# EAGLE design Rocketometer2148 MPU9150 GPS No Osc (EAGLE 6.2)
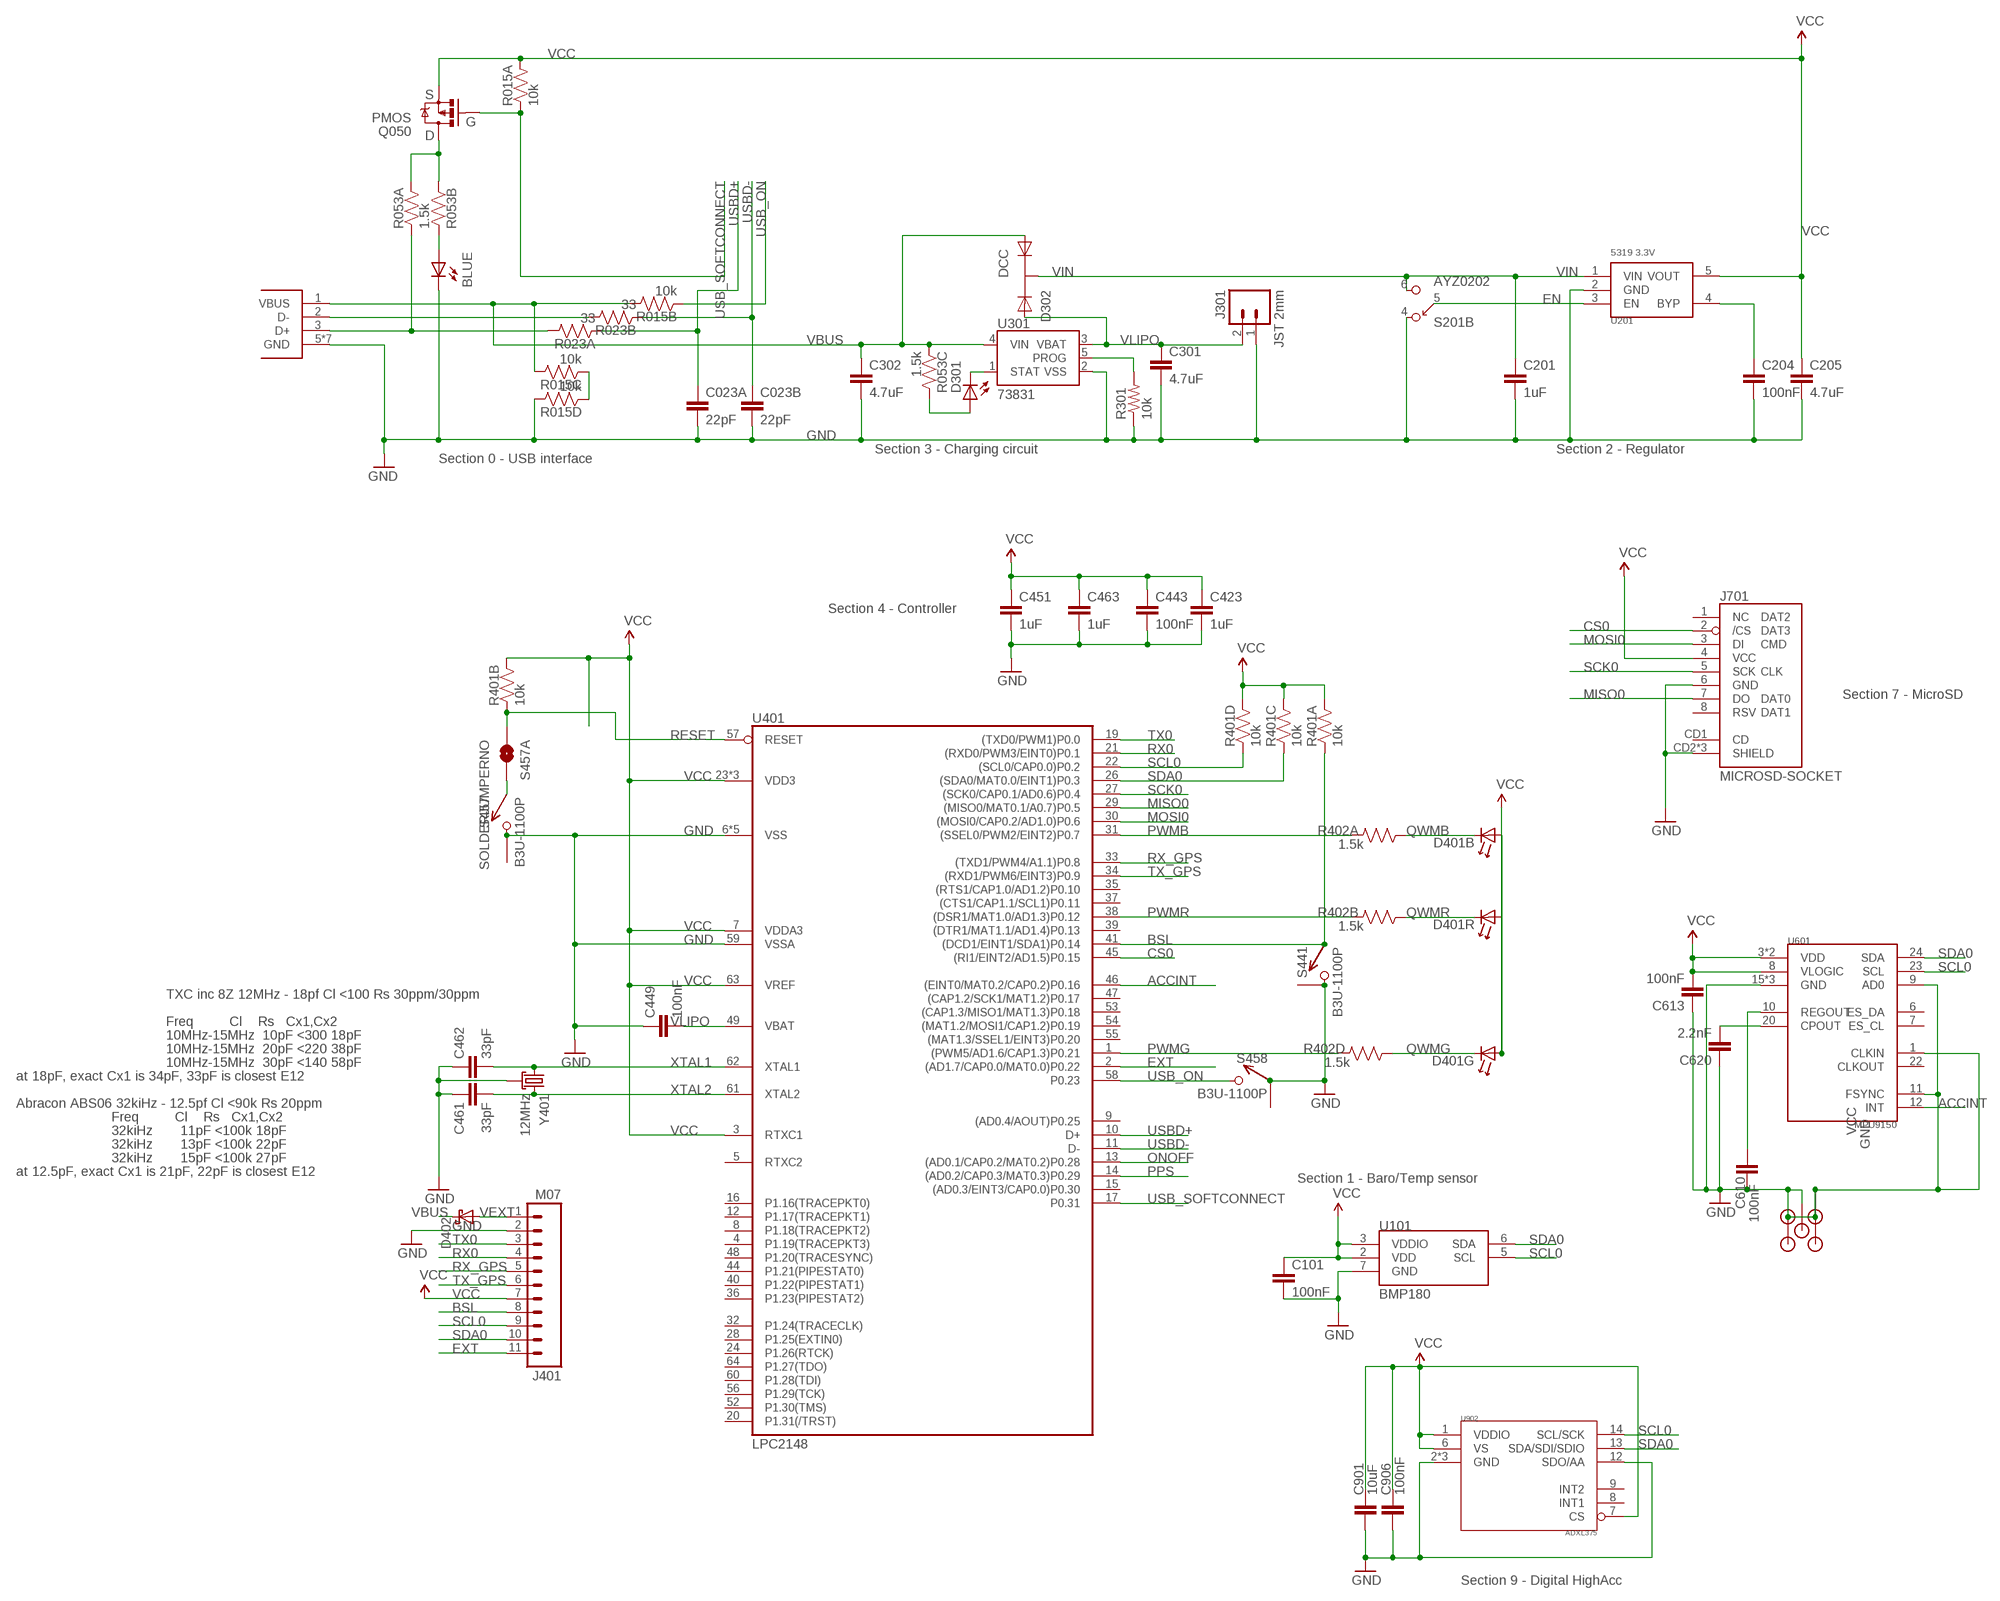
[diagram p0: schematic, sheet 1, part 1 of 2]
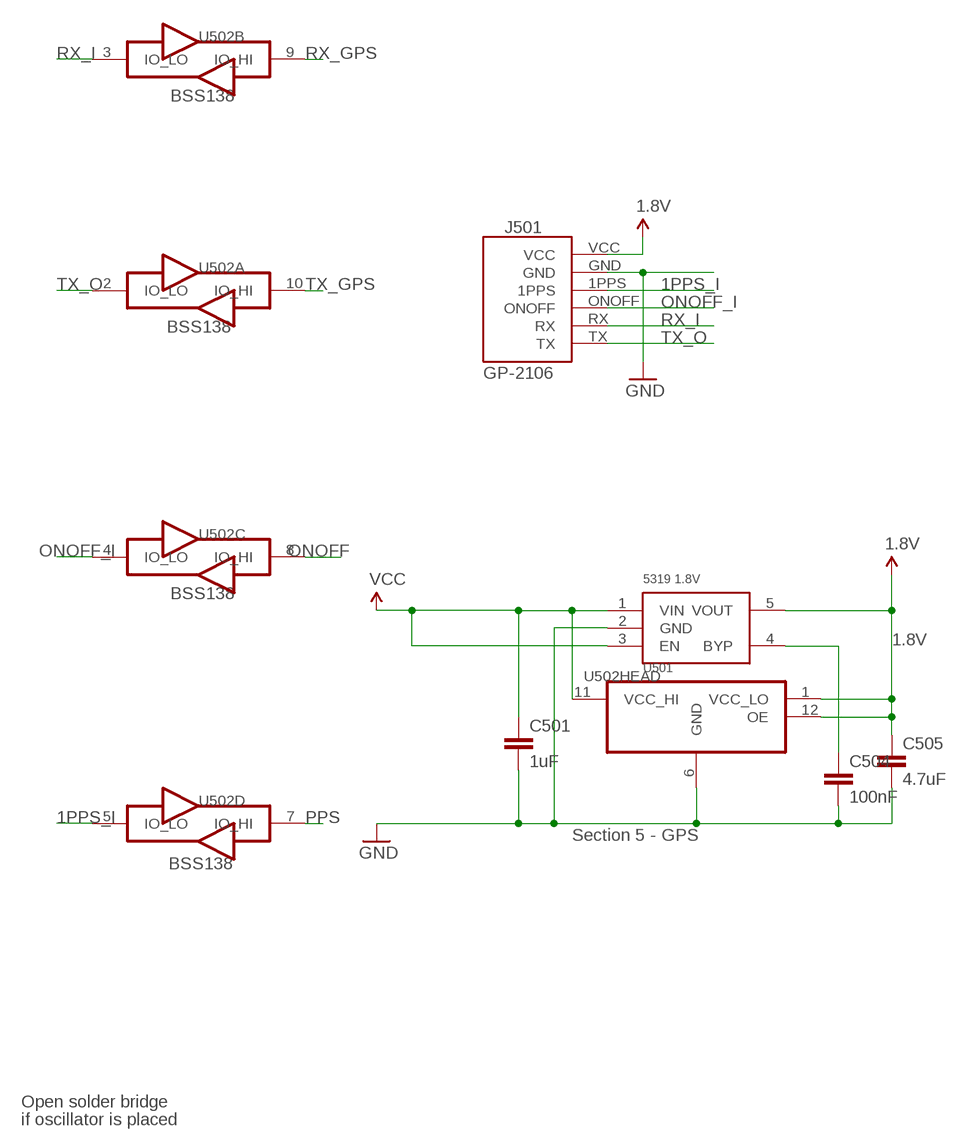
[diagram p1: schematic, sheet 1, part 2 of 2]

## Parts
C023  22pF  CKCM25  [CKCM25]
C101  100nF  CAP0402-CAP  [0402-CAP]
C201  1uF  CAP0402-CAP  [0402-CAP]
C204  100nF  CAP0402-CAP  [0402-CAP]
C205  4.7uF  CAP0402-CAP  [0402-CAP]
C301  4.7uF  CAP0402-CAP  [0402-CAP]
C302  4.7uF  CAP0402-CAP  [0402-CAP]
C423  1uF  CAP0402-CAP  [0402-CAP]
C443  100nF  CAP0402-CAP  [0402-CAP]
C449  100nF  CAP0402-CAP  [0402-CAP]
C451  1uF  CAP0402-CAP  [0402-CAP]
C461  33pF  CAP0402-CAP  [0402-CAP]
C462  33pF  CAP0402-CAP  [0402-CAP]
C463  1uF  CAP0402-CAP  [0402-CAP]
C501  1uF  CAP0402-CAP  [0402-CAP]
C504  100nF  CAP0402-CAP  [0402-CAP]
C505  4.7uF  CAP0402-CAP  [0402-CAP]
C610  100nF  CAP0402-CAP  [0402-CAP]
C613  100nF  CAP0402-CAP  [0402-CAP]
C620  2.2nF  CAP0402-CAP  [0402-CAP]
C901  10uF  CAP0603-CAP  [0603-CAP]
C906  100nF  CAP0402-CAP  [0402-CAP]
D050  BLUE  LED0603  [LED-0603]
D301  YELLOW  LED0603  [LED-0603]
D302  DCC  PMEG2005CT  [SOT-23-3]
D401  SMLP36RGB2W(R)  [SMLP36]
D402  DIODE_SCHOTTKY  [D0603]
J001  USB_MICROB_JSTGCT  [USB_MICROB_3075]
J301  JST 2mm  M02-JST-2MM-SMT  [JST-2-SMD]
J401  M07  M11PTH  [1X11]
J501  GP-2106  [GP-2106]
J701  MICROSD-SOCKET  [MICROSD-SOCKET-PP]
JP1  STANDOFF  [STANDOFF]
JP2  STANDOFF  [STANDOFF]
JP3  STANDOFF  [STANDOFF]
JP4  STANDOFF  [STANDOFF]
JP5  STANDOFF  [STANDOFF]
Q050  PMOS  MOSFET-PCHANNELSMD  [SOT23-3]
R015  10k  RP404  [CRA04]
R023  33  RP2EXB24V  [CRA02]
R053  1.5k  RP404  [CRA04]
R301  10k  RESISTOR0402-RES  [0402-RES]
R401  10k  RP404  [CRA04]
R402  1.5k  RP404  [CRA04]
S201  AYZ0202  [AYZ0202]
S441  B3U-1100P  [B3U-1100P]
S457  B3U-1100P  [B3U-1100P]
S457A  SOLDERJUMPERNO  [SJ_2S-NO]
S458  B3U-1100P  [B3U-1100P]
U101  BMP180  [BMP180]
U201  5319 3.3V  MIC5319D5  [SOT-23-5]
U301  73831  MCP73831  [SOT23-5]
U401  LPC2148  [LQFP64]
U501  5319 1.8V  MIC5319D5  [SOT-23-5]
U502  TXB0104RUT  [R-PUQFN-N12]
U601  MPU9150  [LLGA24]
U902  ADXL375  [ADXL375]
Y401  12MHz  CX2520  [CRYSTAL_SMD_2MM_2_5MM]

## Nets
1.8V: C505.1 J501.VCC U501.5(VOUT) U502.1(HEAD:VCC_LO) U502.12(HEAD:OE)
1PPS_I: J501.1PPS U502.5(D:IO_LO)
ACCINT: U401.46((EINT0/MAT0.2/CAP0.2)P0.16) U601.12(INT)
BSL: J401.8 R401.1 S441.P$1 U401.41((DCD1/EINT1/SDA1)P0.14)
CHARGE_STAT+: D301.A R053.6
CHARGE_STAT-: D301.C U301.1(STAT)
CONN_D+: J001.3(D+) R023.4 R053.1
CONN_D-: J001.2(D-) R023.3
CS0: J701.2(/CS) U401.45((RI1/EINT2/AD1.5)P0.15)
EN: S201.5 U201.3(EN)
EXT: J401.11 U401.2((AD1.7/CAP0.0/MAT0.0)P0.22)
GND [power]: C023.3 C023.4 C101.2 C201.2 C204.2 C205.2 C301.2 C302.2 C423.2 C443.2 C449.1 C451.2 C461.1 C462.1 C463.2 C501.2 C504.2 C505.2 C610.2 C613.1 C620.1 C901.2 C906.2 D050.C J001.5(GND) J001.P$1(GND) J001.P$2(GND) J001.P$3(GND) J001.P$4(GND) J001.P$8(GND) J001.P$10(GND) J301.1 J401.2 J501.GND J701.6(GND) J701.CD2(SHIELD) J701.GND1(SHIELD) J701.GND3(SHIELD) JP1.P$1 JP2.P$1 JP3.P$1 JP4.P$1 JP5.P$1 R015.5 R301.1 S201.4 S441.P$2 S441.P$3 S457.P$2 S457.P$3 S458.P$1 S458.P$3 U101.7(GND) U201.2(GND) U301.2(VSS) U401.6(VSS) U401.18(VSS) U401.25(VSS) U401.42(VSS) U401.50(VSS) U401.59(VSSA) U501.2(GND) U502.6(HEAD:GND) U601.1(CLKIN) U601.9(AD0) U601.11(FSYNC) U601.15(GND) U601.17(GND) U601.18(GND) U902.2(GND) U902.4(GND) U902.5(GND) U902.12(SDO/AA) Y401.2(GND) Y401.4(GND)
MISO0: J701.7(DO) U401.29((MISO0/MAT0.1/A0.7)P0.5)
MOSI0: J701.3(DI) U401.30((MOSI0/CAP0.2/AD1.0)P0.6)
N$1: C620.2 U601.20(CPOUT)
N$2: R301.2 U301.5(PROG)
N$3: R015.3 R015.4
N$9 [power]: S457.P$1 S457A.2
N$12: C504.1 U501.4(BYP)
N$13: C610.1 U601.10(REGOUT)
N$17: C204.1 U201.4(BYP)
ONOFF: U401.13((AD0.1/CAP0.2/MAT0.2)P0.28) U502.8(C:IO_HI)
ONOFF_I: J501.ONOFF U502.4(C:IO_LO)
PPS: U401.14((AD0.2/CAP0.3/MAT0.3)P0.29) U502.7(D:IO_HI)
PWMB: R402.8 U401.31((SSEL0/PWM2/EINT2)P0.7)
PWMG: R402.5 U401.1((PWM5/AD1.6/CAP1.3)P0.21)
PWMR: R402.7 U401.38((DSR1/MAT1.0/AD1.3)P0.12)
QWMB: D401.1(B:C) R402.1
QWMG: D401.5(G:C) R402.4
QWMR: D401.3(R:C) R402.2
RESET [power]: R401.2 S457A.1 U401.57(RESET)
RX0: J401.4 U401.21((RXD0/PWM3/EINT0)P0.1)
RX_GPS: J401.5 U401.33((TXD1/PWM4/A1.1)P0.8) U502.9(B:IO_HI)
RX_I: J501.RX U502.3(B:IO_LO)
SCK0: J701.5(SCK) U401.27((SCK0/CAP0.1/AD0.6)P0.4)
SCL0: J401.9 R401.4 U101.5(SCL) U401.22((SCL0/CAP0.0)P0.2) U601.23(SCL) U902.14(SCL/SCK)
SDA0: J401.10 R401.3 U101.6(SDA) U401.26((SDA0/MAT0.0/EINT1)P0.3) U601.24(SDA) U902.13(SDA/SDI/SDIO)
TX0: J401.3 U401.19((TXD0/PWM1)P0.0)
TX_GPS: J401.6 U401.34((RXD1/PWM6/EINT3)P0.9) U502.10(A:IO_HI)
TX_O: J501.TX U502.2(A:IO_LO)
USB_ON: R015.2 S458.P$2 U401.58(P0.23)
USB_SOFTCONNECT: Q050.1(G) R015.1 U401.17(P0.31)
USBD+: C023.1 R023.1 U401.10(D+)
USBD-: C023.2 R023.2 U401.11(D-)
USBLIGHT+: D050.A R053.7
USBON+: Q050.3(D) R053.2 R053.8
VBUS [power]: C302.1 D302.1(A1) D402.C(K) J001.1(VBUS) R015.6 R015.7 R053.3 U301.4(VIN)
VCC [power]: C101.1 C205.1 C423.1 C443.1 C451.1 C463.1 C501.1 C613.2 C901.1 C906.1 D401.2(B:A) D401.4(R:A) D401.6(G:A) J401.7 J701.4(VCC) Q050.2(S) R015.8 R401.5 R401.6 R401.7 R401.8 U101.2(VDD) U101.3(VDDIO) U201.5(VOUT) U401.3(RTXC1) U401.7(VDDA3) U401.23(VDD3) U401.43(VDD3) U401.51(VDD3) U401.63(VREF) U501.1(VIN) U501.3(EN) U502.11(HEAD:VCC_HI) U601.3(VDD) U601.8(VLOGIC) U601.13(VDD) U902.1(VDDIO) U902.6(VS) U902.7(CS)
VEXT [power]: D402.A J401.1
VIN: C201.1 D302.3(K) S201.6 U201.1(VIN)
VLIPO [power]: C301.1 C449.2 D302.2(A2) J301.2 U301.3(VBAT) U401.49(VBAT)
XTAL1: C462.2 U401.62(XTAL1) Y401.1
XTAL2: C461.2 U401.61(XTAL2) Y401.3
Unconnected: J701.1(NC) J701.8(RSV) J701.CD1(CD) R053.4 R053.5 R402.3 R402.6 S201.1 S201.2 S201.3 U401.4(P1.19(TRACEPKT3)) U401.5(RTXC2) U401.8(P1.18(TRACEPKT2)) U401.9((AD0.4/AOUT)P0.25) U401.12(P1.17(TRACEPKT1)) U401.15((AD0.3/EINT3/CAP0.0)P0.30) U401.16(P1.16(TRACEPKT0)) U401.20(P1.31(/TRST)) U401.24(P1.26(RTCK)) U401.28(P1.25(EXTIN0)) U401.32(P1.24(TRACECLK)) U401.35((RTS1/CAP1.0/AD1.2)P0.10) U401.36(P1.23(PIPESTAT2)) U401.37((CTS1/CAP1.1/SCL1)P0.11) U401.39((DTR1/MAT1.1/AD1.4)P0.13) U401.40(P1.22(PIPESTAT1)) U401.44(P1.21(PIPESTAT0)) U401.47((CAP1.2/SCK1/MAT1.2)P0.17) U401.48(P1.20(TRACESYNC)) U401.52(P1.30(TMS)) U401.53((CAP1.3/MISO1/MAT1.3)P0.18) U401.54((MAT1.2/MOSI1/CAP1.2)P0.19) U401.55((MAT1.3/SSEL1/EINT3)P0.20) U401.56(P1.29(TCK)) U401.60(P1.28(TDI)) U401.64(P1.27(TDO)) U601.6(ES_DA) U601.7(ES_CL) U601.22(CLKOUT) U902.8(INT1) U902.9(INT2)

## Notes on the sheet
- S
- G
- D
- BSS138
- Section 0 - USB interface | Section 3 - Charging circuit | Section 2 - Regulator
- BSS138
- Section 4 - Controller
- BSS138
- Section 7 - MicroSD
- Section 5 - GPS
- BSS138
- TXC inc 8Z 12MHz - 18pf Cl <100 Rs 30ppm/30ppm
- Freq         Cl    Rs   Cx1,Cx2
- 10MHz-15MHz  10pF <300 18pF
- 10MHz-15MHz  20pF <220 38pF
- 10MHz-15MHz  30pF <140 58pF | Open solder bridge
- at 18pF, exact Cx1 is 34pF, 33pF is closest E12 | if oscillator is placed
- Abracon ABS06 32kiHz - 12.5pf Cl <90k Rs 20ppm
- Freq         Cl    Rs   Cx1,Cx2
- 32kiHz       11pF <100k 18pF
- 32kiHz       13pF <100k 22pF
- 32kiHz       15pF <100k 27pF
- at 12.5pF, exact Cx1 is 21pF, 22pF is closest E12
- Section 1 - Baro/Temp sensor
- Section 9 - Digital HighAcc

## Library data of the parts
C023 = KwanSystems:CKC; DIGIKEY: 445-1860-1-ND
C101 C204 C443 C449 C504 C610 C613 = SparkFun:CAP: Capacitor Standard 0603 ceramic capacitor, and 0.1" leaded capacitor.; DIGIKEY: 445-1265-1-ND
C201 C423 C451 C463 C501 = SparkFun:CAP: Capacitor Standard 0603 ceramic capacitor, and 0.1" leaded capacitor.; DIGIKEY: 445-4114-1-ND
C205 C301 C302 C505 = SparkFun:CAP: Capacitor Standard 0603 ceramic capacitor, and 0.1" leaded capacitor.; DIGIKEY: 445-7395-1-ND
C461 C462 = SparkFun:CAP: Capacitor Standard 0603 ceramic capacitor, and 0.1" leaded capacitor.; DIGIKEY: 445-1241-1-ND
C620 = SparkFun:CAP: Capacitor Standard 0603 ceramic capacitor, and 0.1" leaded capacitor.; DIGIKEY: 445-1257-1-ND
C901 = SparkFun:CAP: Capacitor Standard 0603 ceramic capacitor, and 0.1" leaded capacitor.; DIGIKEY: 445-7486-1-ND
C906 = SparkFun-Passives:CAP: Capacitor Standard 0603 ceramic capacitor, and 0.1" leaded capacitor.; DIGIKEY: 445-1265-1-ND
D050 = SparkFun:LED: LEDs Standard schematic elements and footprints for 5mm, 3mm, 1206, and 0603 sized LEDs. 5mm - Spark Fun Electronics SKU : COM-00529 (and others); DIGIKEY: 350-2037-1-ND
D301 = SparkFun:LED: LEDs Standard schematic elements and footprints for 5mm, 3mm, 1206, and 0603 sized LEDs. 5mm - Spark Fun Electronics SKU : COM-00529 (and others); DIGIKEY: 350-2032-1-ND
D302 = KwanSystems:PMEG2005CT; DIGIKEY: 568-6500-1-ND
D401 = KwanSystems:SMLP36RGB2W(R); DIGIKEY: 846-1097-1-ND
D402 = KwanSystems:DIODE_SCHOTTKY
J001 = KwanSystems:USB_MICROB_JST; DIGIKEY: 609-4616-2-ND
J301 = SparkFun:M02: Header 2 Standard 2-pin 0.1" header. Use with straight break away headers (SKU : PRT-00116), right angle break away headers (PRT-00553), swiss pins (PRT-00743), machine pins (PRT-00117), and female headers (PRT-00115). Molex polarized connector foot print use with SKU : PRT-08233 with associated crimp pins and housings.; DIGIKEY: 455-1749-1-ND
J401 = SparkFun-Connectors:M11: Header 11 Standard 11-pin 0.1" header. Use with straight break away headers (SKU : PRT-00116), right angle break away headers (PRT-00553), swiss pins (PRT-00743), machine pins (PRT-00117), and female headers (PRT-00115).; DIGIKEY: $NOPART
J501 = SparkFun:GP-2106: GP-2106 GPS SiRF IV
J701 = KwanSystems:MICROSD-SOCKET: microSD Socket Push-push type uSD socket. Digikey 101-00660-68-6-1-ND. tDoc lines correctly indicate media card edge positions when inserting (unlocked, locked, depressed).; DIGIKEY: 101-00581-59-1-ND
JP1-JP5 = KwanSystems:STANDOFF; DIGIKEY: $NOPART
Q050 = SparkFun:MOSFET-PCHANNEL; DIGIKEY: NTR1P02T1GOSCT-ND
R015 = KwanSystems:RP4; DIGIKEY: Y5103CT-ND
R023 = KwanSystems:RP2
R053 R402 = KwanSystems:RP4; DIGIKEY: CRA4S81.5KCT-ND
R301 = SparkFun:RESISTOR: Resistor Basic schematic elements and footprints for 0603, 1206, and PTH resistors.; DIGIKEY: P10.0KLCT-ND
R401 = KwanSystems:RP4; DIGIKEY: CRA4S810KCT-ND
S201 = KwanSystems:AYZ0202; DIGIKEY: 401-2013-1-ND
S441 S457 S458 = KwanSystems:B3U-1100P; DIGIKEY: SW1021CT-ND
S457A = SparkFun-Passives:SOLDERJUMPER: Solder Jumper Standard SMD solder jumper. Used to automate production. Two varients : Normally Open and Normally Closed are the same, but have different paste layers. NC will have a large amount of paste and should jumper during reflow.; DIGIKEY: $NOPART
U101 = KwanSystems:BMP180; DIGIKEY: 828-1027-1-ND
U201 U501 = KwanSystems:MIC5319; DIGIKEY: 576-1910-1-ND
U301 = SparkFun:MCP73831: Microchip's MCP73831 Miniature single cell, fully integrated Li-Ion, Li-polymer charge management controller http://ww1.microchip.com/downloads/en/DeviceDoc/21984a.pdf; DIGIKEY: MCP73831T-2ACI/OTCT-ND
U401 = KwanSystems:LPC2148
U502 = KwanSystems:TXB0104
U601 = KwanSystems:MPU9150; DIGIKEY: $NOPART
U902 = KwanSystems:ADXL375; DIGIKEY: ADXL375BCCZ-ND
Y401 = KwanSystems:CX2520; DIGIKEY: 887-1487-1-ND

## Net classes
0 default: width 0.152 mm, drill 0.33 mm, clearance 0.152 mm
1 power: width 0.152 mm, drill 0.33 mm, clearance 0.152 mm to class 0, clearance 0.152 mm
2 hv: width 0.152 mm, drill 0.33 mm, clearance 0.152 mm to class 0, clearance 0.152 mm to class 1, clearance 0.152 mm

## Board
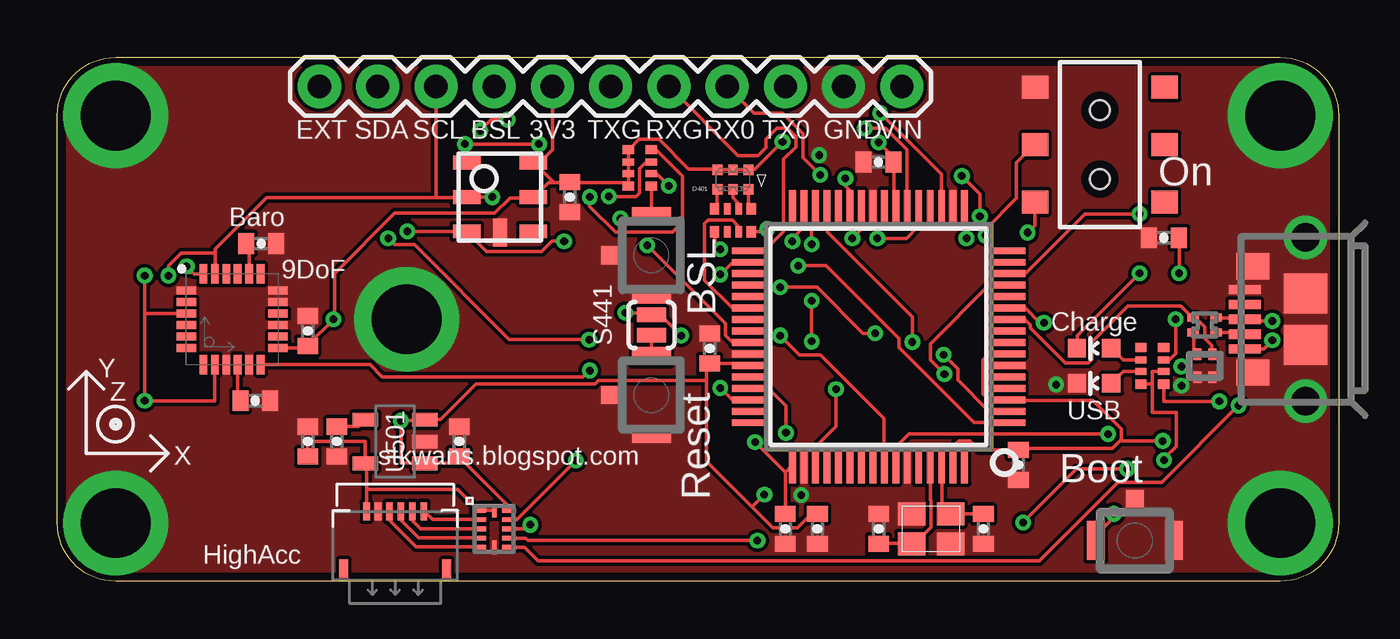
[diagram p2: board, top side]
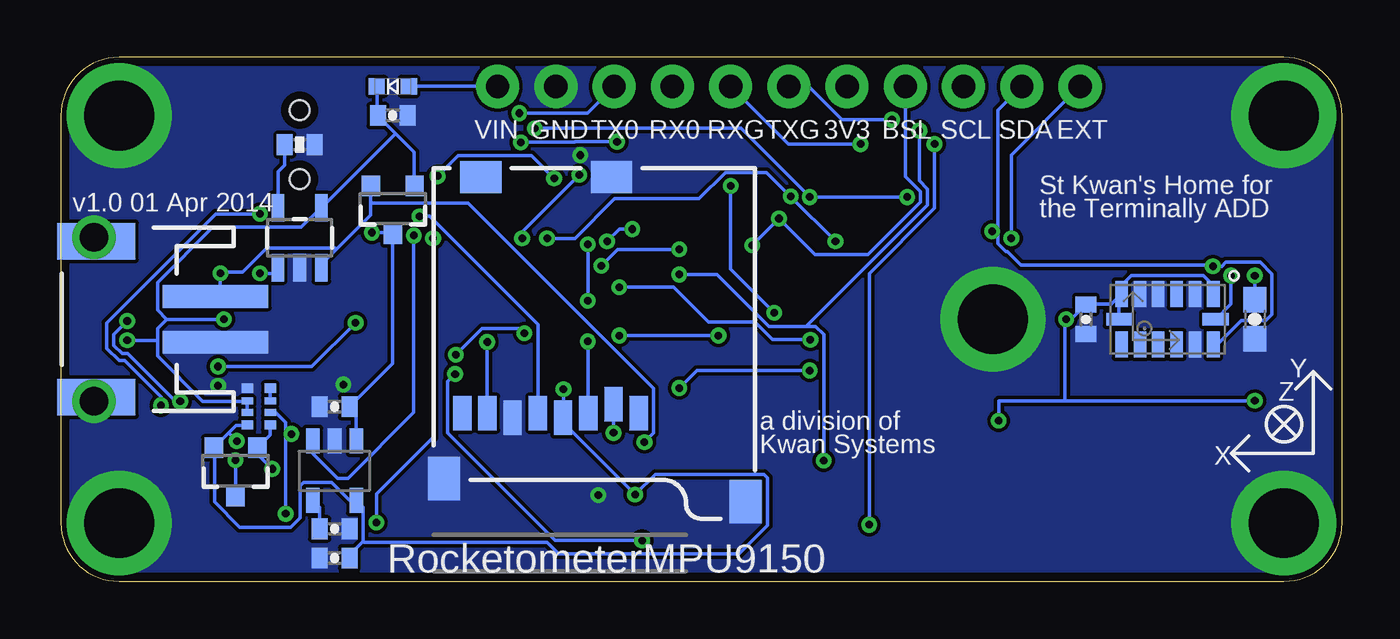
[diagram p3: board, bottom side, seen from below]

Size 55.88 x 22.86 mm. Coordinates in mm from the lower left corner, seen from the top.
Outline: 2.54,22.86 53.34,22.86 arc-90 55.88,20.32 55.88,2.54 arc-90 53.34,0 2.54,0 arc-90 0,2.54 0,20.32 arc-90 2.54,22.86
Copper layers (1*16): Top 0.0356mm / dielectric 1.5011mm / Bottom 0.0356mm
Design rules: minimum track width 6mil, minimum drill 13mil, track to track 6mil, track to pad 6mil, pad to pad 6mil, via to via 6mil, smd to smd 6mil, copper to edge 15mil, drill to drill 6mil, minimum pad ring 7mil, minimum via ring 7mil, stop-mask expansion 4mil, vias tented up to drill 14mil, thermal gap 10mil

### Footprints (pad centres in the part's own frame; a part is rotated, then mirrored left to right if it is on the bottom)
CKCM25 = smd 0.35 x 0.5: 1 -0.325,-0.5; 2 0.325,-0.5; 3 0.325,0.5; 4 -0.325,0.5
0402-CAP = smd 0.7 x 0.9: 1 -0.65,0; 2 0.65,0
0603-CAP = smd 1.1 x 1: 1 -0.85,0; 2 0.85,0
LED-0603 = smd 0.8 x 0.8: A 0,-0.75; C 0,0.75
SOT-23-3 = smd 0.9 x 0.8: 1 -1,0.95; 2 -1,-0.95; 3 1.1,0
SMLP36 = smd 0.45 x 0.45: 1 -0.675,0.425; 2 -0.675,-0.425; 5 0.675,0.425; 6 0.675,-0.425 | smd 0.4 x 0.45: 3 0,0.425; 4 0,-0.425
D0603 = smd 0.7 x 0.7: A -0.7,0; C 0.7,0
USB_MICROB_3075 = smd 0.4 x 1.4: 1 -1.3,4.1; 2 -0.65,4.1; 3 0,4.1; 4 0.65,4.1; 5 1.3,4.1 | smd 1.15 x 1.45: P$1 2.32,3.75; P$10 -2.32,3.75 | smd 1.75 x 1.9: P$2 1.125,1.45; P$8 -1.125,1.45 | drill 1.25 pad 1.9: P$3 -3.575,1.45; P$4 3.575,1.45
JST-2-SMD = smd 1 x 4.6: 1 -1,-3.7; 2 1,-3.7 | smd 1.6 x 3.4: NC1 -3.4,1.5; NC2 3.4,1.5
1X11 = drill 1.016 pad 1.88: 1 0,0; 2 2.54,0; 3 5.08,0; 4 7.62,0; 5 10.16,0; 6 12.7,0; 7 15.24,0; 8 17.78,0; 9 20.32,0; 10 22.86,0; 11 25.4,0
GP-2106 = smd 0.3 x 0.8: 1PPS -0.25,0; GND -0.75,0; ONOFF 0.25,0; RX 0.75,0; TX 1.25,0; VCC -1.25,0 | smd 0.4 x 0.8: P$7 -2.25,-2.5; P$8 2.25,-2.5
MICROSD-SOCKET-PP = smd 0.8 x 1.5: 1 -8.94,10.7; 2 -7.84,10.3; 3 -6.74,10.7; 4 -5.64,10.9; 5 -4.54,10.7; 6 -3.44,10.9; 7 -2.34,10.7; 8 -1.24,10.7 | smd 1.8 x 1.4: CD1 -2.05,0.4; CD2 -7.75,0.4 | smd 1.4 x 1.9: GND1 -13.6,14.55; GND3 -0.45,13.55
STANDOFF = drill 3.048 pad 4.572: P$1 0,0
SOT23-3 = smd 0.8 x 0.9: 1 -0.95,-1; 2 0.95,-1; 3 0,1.1
CRA04 = smd 0.4 x 0.5: 1 -0.8,-0.5; 4 0.8,-0.5; 5 0.8,0.5; 8 -0.8,0.5 | smd 0.3 x 0.5: 2 -0.25,-0.5; 3 0.25,-0.5; 6 0.25,0.5; 7 -0.25,0.5
CRA02 = smd 0.35 x 0.5: 1 -0.325,-0.5; 2 0.325,-0.5; 3 0.325,0.5; 4 -0.325,0.5
0402-RES = smd 0.7 x 0.9: 1 -0.65,0; 2 0.65,0
AYZ0202 = smd 1 x 1.15: 1 -2.5,2.825; 2 0,2.825; 3 2.5,2.825; 4 -2.5,-2.825; 5 0,-2.825; 6 2.5,-2.825 | hole 0.85: 1.5,0; -1.5,0
B3U-1100P = smd 0.8 x 1.7: P$1 -1.7,0; P$2 1.7,0 | smd 0.8 x 1.1: P$3 0,-1.65
SJ_2S-NO = smd 0.635 x 1.27: 1 -0.45,0; 2 0.45,0
BMP180 = smd 0.6 x 1.2: 1 1.5,1.45; 2 0,1.45; 3 -1.5,1.45; 4 -1.5,-1.45; 5 0,-1.45; 6 1.5,-1.45 | smd 1.2 x 0.6: 7 1.55,0
SOT-23-5 = smd 0.6 x 1.1: 1 -0.95,-1.3; 2 0,-1.3; 3 0.95,-1.3; 4 0.95,1.3; 5 -0.95,1.3
SOT23-5 = smd 0.55 x 1.2: 1 -0.95,-1.3; 2 0,-1.3; 3 0.95,-1.3; 4 0.95,1.3; 5 -0.95,1.3
LQFP64 = smd 0.3 x 1.6: 1 -3.75,-5.6; 2 -3.25,-5.6; 3 -2.75,-5.6; 4 -2.25,-5.6; 5 -1.75,-5.6; 6 -1.25,-5.6; 7 -0.75,-5.6; 8 -0.25,-5.6; 9 0.25,-5.6; 10 0.75,-5.6; 11 1.25,-5.6; 12 1.75,-5.6; 13 2.25,-5.6; 14 2.75,-5.6; 15 3.25,-5.6; 16 3.75,-5.6; 33 3.75,5.6; 34 3.25,5.6; 35 2.75,5.6; 36 2.25,5.6; 37 1.75,5.6; 38 1.25,5.6; 39 0.75,5.6; 40 0.25,5.6; 41 -0.25,5.6; 42 -0.75,5.6; 43 -1.25,5.6; 44 -1.75,5.6; 45 -2.25,5.6; 46 -2.75,5.6; 47 -3.25,5.6; 48 -3.75,5.6 | smd 1.6 x 0.3: 17 5.6,-3.75; 18 5.6,-3.25; 19 5.6,-2.75; 20 5.6,-2.25; 21 5.6,-1.75; 22 5.6,-1.25; 23 5.6,-0.75; 24 5.6,-0.25; 25 5.6,0.25; 26 5.6,0.75; 27 5.6,1.25; 28 5.6,1.75; 29 5.6,2.25; 30 5.6,2.75; 31 5.6,3.25; 32 5.6,3.75; 49 -5.6,3.75; 50 -5.6,3.25; 51 -5.6,2.75; 52 -5.6,2.25; 53 -5.6,1.75; 54 -5.6,1.25; 55 -5.6,0.75; 56 -5.6,0.25; 57 -5.6,-0.25; 58 -5.6,-0.75; 59 -5.6,-1.25; 60 -5.6,-1.75; 61 -5.6,-2.25; 62 -5.6,-2.75; 63 -5.6,-3.25; 64 -5.6,-3.75
R-PUQFN-N12 = smd 0.2 x 0.6: 1 -0.8,-0.65; 2 -0.4,-0.65; 3 0,-0.65; 4 0.4,-0.65; 5 0.8,-0.65; 7 0.8,0.65; 8 0.4,0.65; 9 0,0.65; 10 -0.4,0.65; 11 -0.8,0.65 | smd 0.6 x 0.2: 6 0.8,0; 12 -0.8,0
LLGA24 = smd 0.85 x 0.34: 1 -2,1.25; 2 -2,0.75; 3 -2,0.25; 4 -2,-0.25; 5 -2,-0.75; 6 -2,-1.25; 13 2,-1.25; 14 2,-0.75; 15 2,-0.25; 16 2,0.25; 17 2,0.75; 18 2,1.25 | smd 0.34 x 0.85: 7 -1.25,-1.975; 8 -0.75,-1.975; 9 -0.25,-1.975; 10 0.25,-1.975; 11 0.75,-1.975; 12 1.25,-1.975; 19 1.25,1.975; 20 0.75,1.975; 21 0.25,1.975; 22 -0.25,1.975; 23 -0.75,1.975; 24 -1.25,1.975
ADXL375 = smd 0.55 x 1.145: 1 2,1.097; 2 1.2,1.097; 3 0.4,1.097; 4 -0.4,1.097; 5 -1.2,1.097; 6 -2,1.097; 8 -2,-1.097; 9 -1.2,-1.097; 10 -0.4,-1.097; 11 0.4,-1.097; 12 1.2,-1.097; 13 2,-1.097 | smd 1.145 x 0.55: 7 -2.098,0; 14 2.098,0
CRYSTAL_SMD_2MM_2_5MM = smd 1.2 x 1: 1 -0.85,-0.65; 2 0.85,-0.65; 3 0.85,0.65; 4 -0.85,0.65

### Placement (x,y rotation side)
C023  50.04,9.4 180 top
C101  22.35,16.76 270 top
C201  43.94,7.62 180 bottom
C204  43.94,2.29 0 bottom
C205  43.94,1.02 180 bottom
C301  48.26,14.99 180 top
C302  41.4,20.32 0 bottom
C423  35.81,18.29 180 top
C443  28.45,10.16 90 top
C449  31.75,2.29 90 top
C451  33.15,2.29 270 top
C461  35.81,2.29 270 top
C462  40.39,2.29 90 top
C463  41.91,5.08 270 top
C501  17.53,6.1 90 top
C504  12.19,6.1 270 top
C505  10.92,6.1 90 top
C610  8.64,7.87 0 top
C613  10.92,10.92 270 top
C620  8.89,14.73 180 top
C901  3.81,11.43 270 bottom
C906  11.18,11.43 270 bottom
D050  45.21,8.64 90 top
D301  45.21,10.16 90 top
D302  41.4,16.26 270 bottom
D401  29.46,17.53 180 top
D402  41.4,21.59 180 bottom
J001  55.88,11.43 90 top
J301  52.83,11.43 90 bottom
J401  36.83,21.59 180 top
J501  14.73,3.05 0 top
J701  39.62,18.03 180 bottom
JP1  2.54,2.54 0 top
JP2  2.54,20.32 0 top
JP3  15.24,11.43 0 top
JP4  53.34,2.54 0 top
JP5  53.34,20.32 0 top
Q050  48.26,4.83 180 bottom
R015  47.24,7.62 90 bottom
R023  50.04,11.18 270 top
R053  47.75,9.4 90 top
R301  45.47,19.05 180 bottom
R401  25.4,18.03 90 top
R402  29.46,15.75 180 top
S201  45.47,19.05 270 top
S441  25.91,14.22 270 top
S457  25.91,8.13 270 top
S457A  25.91,11.18 270 top
S458  46.99,1.78 180 top
U101  19.3,16.76 270 top
U201  43.94,4.83 180 bottom
U301  45.47,14.99 0 bottom
U401  35.81,10.67 90 top
U501  14.73,6.1 90 top
U502  19.05,2.29 270 top
U601  7.62,11.43 0 top
U902  7.62,11.43 0 bottom
U$4  [AXES]  1.27,5.59 0 top
Y401  38.1,2.29 180 top

### Tracks (layer width: path | path; a pad name or v marks a point on that pad's centre or on a via)
1.8V
  Top 0.152: U502.12 18.41,3.1 U502.1 18.34,3.12 17.45,4.01 13.48,4.01 | 13.46,3.05 J501.VCC 13.48,3.81 13.48,4.01 | 10.92,5.44 C505.1 10.92,6.1 13.43,6.1 U501.5 | 13.44,5.13 U501.5 | U501.5 13.48,5.15 13.48,4.01
1PPS_I
  Top 0.152: U502.5 15.65,1.5 14.5,2.64 14.5,3.05 J501.1PPS
ACCINT  (via drill 0.33)
  Top 0.152: v23.22,9.2 22.94,8.91 14.17,8.91 13.64,9.45 8.89,9.45 U601.12 | v28.91,8.43 29.41,7.92 U401.46
  Bottom 0.152: v23.22,9.2 28.14,9.2 v28.91,8.43
BSL  (via drill 0.33)
  Top 0.152: R401.1 S441.P$1 25.86,15.88 25.81,15.82 v24.56,15.82 | v25.73,14.66 29.13,11.25 29.13,10.72 29.41,10.44 30.2,10.44 U401.41
  Bottom 0.152: v25.73,14.66 v24.56,15.82 22.99,14.25 20.68,14.25 18.39,16.54 18.39,16.99 19.05,17.65 J401.8
CHARGE_STAT+
  Top 0.152: R053.6 46.48,9.65 45.97,10.16 D301.A
CHARGE_STAT-  (via drill 0.33)
  Top 0.152: v47.19,13.44 44.48,10.72 44.48,10.16 D301.C
  Bottom 0.152: v47.19,13.44 46.66,13.44 46.43,13.66 U301.1
CONN_D+  (via drill 0.33)
  Top 0.152: v50.67,7.85 48.25,7.85 R053.1 48.26,8.59 | v52.98,11.35 51.87,11.35 J001.3 51.74,11.48 50.55,11.48 R023.4
  Bottom 0.152: v50.67,7.85 50.88,7.85 52.96,9.93 53.21,9.93 53.57,10.29 53.57,10.77 v52.98,11.35
CONN_D-
  Top 0.152: R023.3 51.71,10.85 51.77,10.79 J001.2
CS0  (via drill 0.33)
  Top 0.152: v31.77,6.48 31.77,7.64 31.01,8.41 30.23,8.41 U401.45
  Bottom 0.152: v31.77,6.48 J701.2
EN  (via drill 0.33)
  Top 0.152: v40.49,15.09 40.49,15.37 41.83,16.71 41.83,18.26 42.62,19.05 S201.5
  Bottom 0.152: v40.49,15.09 40.49,7.37 43.36,4.5 43.81,4.5 44.88,5.56 U201.3
EXT  (via drill 0.33)
  Top 0.152: v38.66,9.88 39.27,9.27 39.27,8.79 40.62,7.44 41.4,7.44 U401.2 | v35.66,10.82 35.13,10.82 33.12,12.83 v31.52,12.83 | v23.19,10.54 19.71,10.54 15.57,14.68 14.71,14.68 v14.43,14.96
  Bottom 0.152: v38.66,9.88 37.52,11.02 35.87,11.02 v35.66,10.82 | v31.52,12.83 29.16,12.83 27.64,11.3 25.6,11.3 24.84,10.54 v23.19,10.54 | v14.43,14.96 14.43,18.59 J401.11
GND  (via drill 0.33)
  other vias: 43.56,8.59 49.02,8.53 33.22,18.59 32.44,3.76
  pour Top (no thermals): 2.54,22.86 53.34,22.86 55.88,22.86 55.88,2.54 arc-90 53.34,0 2.54,0 arc-90 0,2.54 0,20.32 arc-90
  pour Bottom (no thermals): 2.54,22.86 53.34,22.86 55.88,22.86 55.88,2.54 arc-90 53.34,0 2.54,0 arc-90 0,2.54 0,20.32 arc-90
MISO0  (via drill 0.33)
  Top 0.152: v37.29,10.44 37.29,11.53 33.58,15.24 33.58,16.26 U401.29
  Bottom 0.152: v37.29,10.44 J701.7
MOSI0  (via drill 0.33)
  Top 0.152: v32.89,12.24 v32.89,10.46 | v32.89,14.71 32.89,15.32 33.05,15.47 33.05,16.26 U401.30
  Bottom 0.152: v32.89,10.46 32.89,7.34 J701.3 | v32.89,14.71 v32.89,12.24
N$1
  Top 0.152: U601.20 8.36,13.41 8.36,14.63 8.26,14.73 C620.2
N$2
  Bottom 0.152: R301.2 46.13,18.16 46.41,17.88 46.41,16.31 U301.5
N$3
  Bottom 0.152: R015.3 46.76,7.87 46.76,8.41 R015.4
N$9
  Top 0.152: S457.P$1 S457A.2
N$12
  Top 0.152: C504.1 13.13,6.76 13.41,7.04 U501.4
N$13
  Top 0.152: U601.10 7.87,7.98 7.98,7.87 C610.1
N$17
  Bottom 0.152: C204.1 44.6,2.29 44.6,3.23 44.88,3.5 U201.4
ONOFF  (via drill 0.33)
  Top 0.152: v30.53,1.78 20.52,1.78 20.42,1.88 U502.8 | v38.68,9.04 38.08,9.65 38.08,10.36 40.62,12.9 41.4,12.9 U401.13
  Bottom 0.152: v30.53,1.78 34.31,1.78 39.01,6.48 39.01,8.71 v38.68,9.04
ONOFF_I
  Top 0.152: U502.4 18.39,1.91 15.75,1.91 14.99,2.67 J501.ONOFF
PPS  (via drill 0.33)
  Top 0.152: v51.51,7.67 48.16,4.32 46.25,4.32 42.82,0.89 20.95,0.89 20.37,1.47 19.71,1.47 U502.7 | v47.19,16.03 44.81,16.03 42.22,13.44 41.43,13.44 U401.14
  Bottom 0.152: v51.51,7.67 51.51,8.05 53.09,9.63 53.34,9.63 53.87,10.16 53.87,11.28 49.12,16.03 v47.19,16.03
PWMB  (via drill 0.33)
  Top 0.152: v30.96,15.37 30.86,15.27 30.28,15.27 R402.8 | v32.05,14.83 32.05,14.96 32.56,15.47 32.56,16.26 U401.31
  Bottom 0.152: v30.96,15.37 31.52,15.37 v32.05,14.83
PWMG  (via drill 0.33)
  Top 0.152: v28.91,14.48 28.68,14.71 28.68,15.24 R402.5 | v32.31,13.77 33.53,13.77 36.7,10.59 36.7,10.21 39.98,6.93 41.4,6.93 U401.1
  Bottom 0.152: v28.91,14.48 31.6,14.48 v32.31,13.77
PWMR
  Top 0.152: R402.7 29.69,15.27 29.69,15.49 29.44,15.75 28.37,15.75 28.22,15.6 28.22,13.13 29.41,11.94 30.2,11.94 U401.38
QWMB
  Top 0.152: D401.1 30.15,16.36 R402.1
QWMG
  Top 0.152: D401.5 28.78,17.09 28.78,16.36 28.68,16.26 R402.4
QWMR
  Top 0.152: D401.3 29.46,16.74 29.69,16.51 29.69,16.26 R402.2
RESET  (via drill 0.33)
  Top 0.152: v26.67,17.25 26.14,17.78 R401.2 | v24.77,11.71 25.83,11.71 S457A.1 25.96,11.58 26.34,11.58 v27.2,10.72 | v31.52,10.72 32.36,9.88 33.27,9.88 36.04,7.11 36.04,5.08 U401.57
  Bottom 0.152: v26.67,17.25 26.67,13.61 v24.77,11.71 | v27.2,10.72 v31.52,10.72
RX0  (via drill 0.33)
  Top 0.152: v35.76,14.96 37.03,14.96 37.54,15.47 37.54,16.26 U401.21 | v33.27,17.73 32.51,18.49 32.51,19.53 31.62,20.42 30.38,20.42 J401.4
  Bottom 0.152: v35.76,14.96 35.76,15.24 v33.27,17.73
RX_GPS  (via drill 0.33)
  Top 0.152: U502.9 20.45,2.29 v20.62,2.46 | v21.01,19.07 v17.78,19.07 | J401.5 29.69,18.57 30.56,18.57 30.91,18.92 30.91,19.28 31.39,19.76 31.85,19.76 32.21,19.41 32.21,18.95 31.67,18.41 31.67,15.27 30.84,14.43 30.23,14.43 U401.33
  Bottom 0.152: v20.62,2.46 20.62,13.44 17.78,16.28 v17.78,19.07 | v21.01,19.07 24.16,19.07 J401.5
RX_I
  Top 0.152: U502.3 15.85,2.29 15.49,2.64 15.49,3.05 J501.RX
SCK0  (via drill 0.33)
  Top 0.152: v40.23,15.93 40.23,16.89 v39.45,17.68 | v34.37,17.58 34.37,17.25 34.54,17.07 34.54,16.28 U401.27
  Bottom 0.152: v40.23,15.93 39.8,15.93 35.08,11.2 J701.5 | v39.45,17.68 38.56,18.57 35.36,18.57 v34.37,17.58
SCL0  (via drill 0.33)
  Top 0.152: v23.22,16.76 23.22,16.36 24.33,15.24 26.82,15.24 27.25,15.67 27.25,17.68 26.11,18.82 R401.4 | v18.97,16.76 U101.5 17.78,16.74 16.51,16.74 | 6.88,14.33 6.88,14.5 9.12,16.74 16.51,16.74 | 6.88,14.33 6.88,13.41 U601.23 | v4.85,13.34 4.85,13.77 5.41,14.33 6.88,14.33 | v35.2,19.76 36.12,19.76 37.06,18.82 U401.22 | 16.51,16.74 J401.9
  Bottom 0.152: v18.97,16.76 v23.22,16.76 26.21,19.76 v35.2,19.76 | v4.85,13.34 4.85,12.09 U902.14
SDA0  (via drill 0.33)
  Top 0.152: v24.05,16.79 25.25,16.79 25.4,16.94 25.4,18.01 25.65,18.26 25.88,18.26 R401.3 | v22.1,14.83 21.57,14.83 21.11,14.38 18.72,14.38 17.86,15.24 U101.6 17.78,15.27 v15.27,15.27 | v34.67,14.96 35.05,15.34 35.05,16.26 U401.26 | v5.64,13.74 5.97,13.41 6.35,13.41 U601.24
  Bottom 0.152: v22.1,14.83 v24.05,16.79 25.09,17.83 26.9,17.83 28.04,16.69 31.73,16.69 33.45,14.96 v34.67,14.96 | U902.13 5.44,10.34 4.39,11.38 3.33,11.38 3.07,11.63 3.07,13.41 3.58,13.92 5.08,13.92 5.26,13.74 v5.64,13.74 5.69,13.79 14.02,13.79 14.61,14.38 14.66,14.38 15.01,14.73 15.01,15.27 | 15.01,15.27 15.01,20.55 J401.10 | 15.01,15.27 v15.27,15.27
TX0  (via drill 0.33)
  Top 0.152: v35.89,20.42 38.56,17.75 U401.19
  Bottom 0.152: v35.89,20.42 32.92,20.42 J401.3
TX_GPS  (via drill 0.33)
  Top 0.152: v22.61,5.26 20.04,2.69 U502.10 | v28.91,13.39 29.41,13.89 30.2,13.89 U401.34 | v19.63,20.14 18.92,20.14 v18.44,19.66
  Bottom 0.152: v22.61,5.26 22.61,10.77 22.96,11.12 23.32,11.12 | 23.32,11.12 24.99,11.12 27.25,13.39 v28.91,13.39 | J401.6 23.27,21.59 21.82,20.14 v19.63,20.14 | v18.44,19.66 18.44,17.48 18.09,17.12 18.09,16.41 23.32,11.18 23.32,11.12
TX_O
  Top 0.152: U502.2 16.36,2.69 16,3.05 J501.TX
USB_ON  (via drill 0.33)
  Top 0.152: v46.08,2.95 46.08,2.79 45.31,2.03 45.31,1.78 S458.P$2 | v45.82,6.43 37.13,6.43 36.58,5.87 36.58,5.08 U401.58
  Bottom 0.152: v46.08,2.95 46.08,6.43 | 46.08,6.43 46.08,6.93 46.51,7.37 R015.2 | 46.08,6.43 v45.82,6.43
USB_SOFTCONNECT  (via drill 0.33)
  Top 0.152: v46.66,4.9 44.45,4.9 v42.11,2.56 | v39.65,14.96 39.65,16.18 39.57,16.26 U401.17
  Bottom 0.152: R015.1 46.76,6.81 46.76,6.38 47.3,5.84 Q050.1 47.27,5.77 47.27,5.51 v46.66,4.9 | v42.11,2.56 42.11,3.81 39.65,6.27 v39.65,14.96
USBD+
  Top 0.152: C023.1 50.34,9.91 50.34,10.29 50.04,10.59 50.04,11.1 49.66,11.48 49.55,11.48 R023.1 49.48,11.53 49,12.01 46.69,12.01 45.11,10.44 45.11,9.68 44.96,9.53 43.97,9.53 42.44,11.05 42.44,11.18 42.22,11.4 41.43,11.4 U401.10
USBD-  (via drill 0.33)
  Top 0.152: R023.2 49.55,10.85 49.55,10.06 C023.2 49.58,9.93 v49.02,9.37 | v43.03,11.28 42.85,11.28 42.22,11.91 41.43,11.91 U401.11
  Bottom 0.152: v49.02,9.37 44.93,9.37 v43.03,11.28
USBLIGHT+
  Top 0.152: R053.7 46.48,9.14 45.97,8.64 D050.A
USBON+  (via drill 0.33)
  Top 0.152: R053.8 47.27,8.61 47.75,8.61 | 48.23,9.14 R053.2 47.75,9.15 47.75,8.61 | v48.26,5.28 48.26,5.36 48.79,5.89 48.79,7.37 47.75,7.37 47.75,8.13 47.75,8.61
  Bottom 0.152: v48.26,5.28 Q050.3
VBUS  (via drill 0.33)
  Top 0.152: v48.77,11.43 48.77,9.93 48.49,9.65 R053.3 | v52.98,10.52 52.6,10.13 J001.1
  Bottom 0.152: R015.7 47.75,7.39 47.75,7.85 R015.6 47.83,7.85 49.68,7.85 51.66,9.83 51.66,10.52 | 51.26,11.43 v48.77,11.43 | 51.26,11.43 51.66,11.02 51.66,10.52 | 51.66,10.52 v52.98,10.52 | D402.C 42.09,21.59 42.09,20.34 42.06,20.32 C302.1 42.01,20.27 41.27,19.53 | 41.27,19.53 40.46,18.72 40.46,17.27 D302.1 | 41.27,19.53 44.5,16.31 U301.4 44.58,16.26 45.39,15.44 49.25,15.44 51.66,13.03 51.66,11.84 51.26,11.43
VCC  (via drill 0.33)
  Top 0.152: 21.59,17.4 21.41,17.4 20.78,16.76 U101.2 20.7,16.71 19.74,16.71 19.07,16.05 14.71,16.05 12.09,13.44 12.09,11.48 v12.04,11.43 10.95,10.34 C613.2 10.85,10.19 U601.13 | 21.59,17.4 C101.1 22.4,17.4 24.87,17.4 R401.8 24.92,17.25 24.92,17.78 R401.7 24.92,17.86 24.92,18.26 R401.6 24.92,18.34 24.92,18.82 R401.5 24.97,18.87 25.38,19.28 26.24,19.28 27.53,17.98 28.73,17.98 D401.6 28.8,17.96 D401.4 29.52,17.96 30.12,17.96 D401.2 30.2,17.98 30.43,17.98 v31.62,19.18 | 21.59,17.4 21.59,17.45 20.78,18.26 U101.3 20.95,18.19 21.59,18.82 J401.7 | U401.23 36.47,16.36 36.47,18.29 C423.1 36.42,18.34 36.42,18.54 v35.81,19.15 | U601.8 6.86,9.47 6.86,7.87 v3.81,7.87 3.81,11.68 | 3.81,13.06 v3.81,13.34 3.81,11.68 | U502.11 19.68,3.1 19.68,3.28 17.53,5.44 C501.1 17.7,5.16 U501.1 | U401.7 41.4,9.91 40.62,9.91 40.36,9.65 40.36,8.18 40.62,7.92 U401.3 41.48,7.9 45.16,7.9 46.41,6.66 46.41,6.2 46.38,6.17 | U401.63 39.06,5.87 39.32,6.12 39.8,6.12 40.18,5.74 C463.1 41.96,5.79 46,5.79 46.38,6.17 | v48.21,6.12 46.43,6.12 46.38,6.17 | v33.96,8.38 33.96,6.76 33.07,5.87 U401.51 | U401.43 30.12,9.5 C443.1 28.4,9.45 28.32,9.37 28.32,8.76 | 30.3,3.25 28.32,5.23 28.32,8.76 | 30.3,3.25 31.22,2.34 32.28,2.34 32.87,2.92 33.15,2.92 C451.1 | 28.32,8.76 23.6,8.76 23.44,8.61 18.26,8.61 16.71,7.06 16.05,7.06 U501.3 15.98,7.01 v14.99,7.01 14.99,5.16 U501.1 | 30.3,3.25 v30.84,3.79 | U501.1 | U601.3 3.81,11.68
  Bottom 0.152: v35.81,19.15 33.48,19.15 33.45,19.18 v31.62,19.18 | v3.81,13.34 C901.1 | U902.6 10.06,12.09 C906.1 11.23,12.04 11.84,11.43 v12.04,11.43 12.09,11.38 12.09,7.87 | U902.1 5.64,12.55 5.64,12.93 6.04,13.34 9.2,13.34 9.6,12.93 9.6,12.6 U902.6 | U902.6 9.73,12.32 U902.7 9.65,11.4 | 48.56,6.48 49.2,5.84 Q050.2 49.17,5.77 49.17,3.45 48.08,2.36 45.85,2.36 45.44,2.77 45.44,4.17 45.29,4.32 44.07,4.32 43.31,3.56 43.05,3.56 U201.5 42.98,3.5 42.7,3.23 42.7,1.75 | 48.56,6.48 48.23,6.81 47.75,6.81 R015.8 | 42.7,1.75 43.28,1.17 C205.1 | v48.21,6.12 48.56,6.48 | v33.96,8.38 33.96,7.14 J701.4 33.96,7.06 33.96,6.91 v30.84,3.79 29.95,4.67 25.22,4.67 25.07,4.52 25.07,2.44 26.31,1.19 34.16,1.19 34.67,1.7 42.65,1.7 42.7,1.75 | v14.99,7.01 14.96,7.01 14.96,7.87 12.09,7.87 | 12.09,7.87 v3.81,7.87
VEXT
  Bottom 0.152: J401.1 D402.A
VIN  (via drill 0.33)
  Top 0.152: v42.32,15.21 42.62,15.52 42.62,16.54 S201.6
  Bottom 0.152: U201.1 43,6.15 43,7.8 C201.1 41.4,9.5 D302.3 41.43,15.21 v42.32,15.21
VLIPO  (via drill 0.33)
  Top 0.152: v48.92,13.44 C301.1 | 31.75,4.75 C449.2 | 31.75,4.75 32.05,5.05 U401.49 | v30.43,6.07 31.75,4.75
  Bottom 0.152: J301.2 49.12,12.45 48.92,12.65 v48.92,13.44 48.87,13.49 47.95,13.49 46.91,14.53 43.92,14.53 43.87,14.48 | 42.37,16.51 42.37,15.98 43.87,14.48 | 42.37,16.51 42.37,17.25 D302.2 | 43.87,14.48 44.5,13.84 44.5,13.69 U301.3 | v30.43,6.07 30.02,6.48 30.02,8.41 38.12,16.51 42.37,16.51
XTAL1
  Top 0.152: C462.2 38.96,2.95 Y401.1 38.94,3.02 38.58,3.38 38.58,5.05 U401.62
XTAL2
  Top 0.152: C461.2 35.81,1.65 37.24,1.65 Y401.3 37.31,1.68 37.41,1.68 38.1,2.36 38.1,3.53 38.08,3.56 38.08,5.05 U401.61

### Text on the board
tPlace: EXT | SDA | SCL | BSL | 3V3 | TXG | RXG | RX0 | TX0 | GND | VIN | On | Baro | BSL | 9DoF | Charge | USB | stkwans.blogspot.com | Reset | Boot | HighAcc
bPlace: EXT | SDA | SCL | BSL | 3V3 | TXG | RXG | RX0 | TX0 | GND | VIN | St Kwan's Home for | the Terminally ADD | v1.0 01 Apr 2014 | a division of | Kwan Systems | RocketometerMPU9150